# Altium schematic sheet schematic_total.SchDoc
size 297 x 209 mm; SheetNumber: 1; SheetTotal: 1
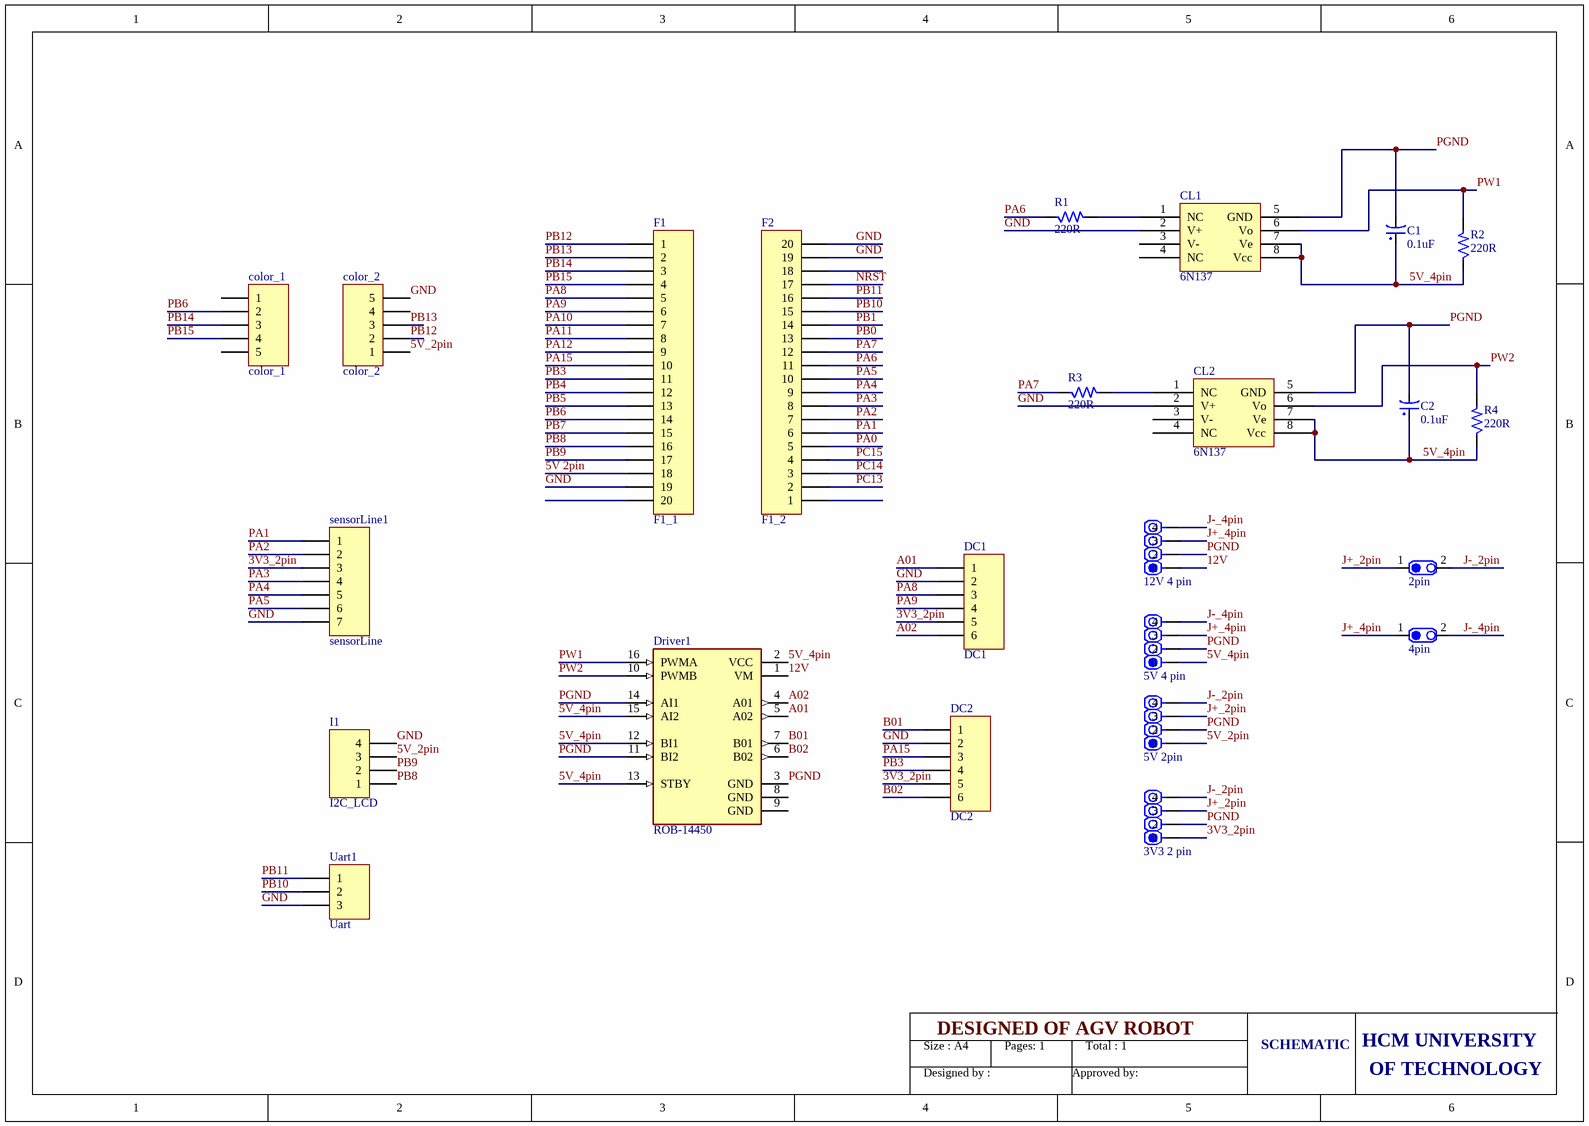
[diagram p0: schematic_total.SchDoc]

## Parts
2pin  IO  [CON.HDR1X2]  (value not drawn)
3V3_2_pin  IO  [CON.HDR1X4]  (value not drawn)
4pin  IO  [CON.HDR1X2]  (value not drawn)
5V_2pin  IO  [CON.HDR1X4]  (value not drawn)
5V_4_pin  IO  [CON.HDR1X4]  (value not drawn)
12V_4_pin  IO  [CON.HDR1X4]  (value not drawn)
C1  0.1uF  [CP1/2]
C2  0.1uF  [CP1/2]
CL1  6N137  [DIP-8]
CL2  6N137  [DIP-8]
color_1  color_1  [HDR1X5]
color_2  color_2  [HDR1X5]
DC1  DC1  [HDR1X6]
DC2  DC2  [HDR1X6]
Driver1  ROB-14450  [MODULE_ROB-14450]
F1  F1_1  [HDR1X20]
F2  F1_2  [HDR1X20]
I1  I2C_LCD  [HDR1X4]
R1  220R  [R1/4W]
R2  220R  [R1/4W]
R3  220R  [R1/4W]
R4  220R  [R1/4W]
sensorLine1  sensorLine  [HDR1X7]
Uart1  Uart  [HDR1X3]

## Nets
3V3_2pin: 3V3_2_pin.1 DC1.5 DC2.5 sensorLine1.3
5V 2pin: F1.18
5V_2pin: 5V_2pin.1 color_2.1 I1.3
5V_4pin: 5V_4_pin.1 C1.1 C2.1 CL1.7(Ve) CL1.8(Vcc) CL2.7(Ve) CL2.8(Vcc) Driver1.2(VCC) Driver1.12(BI1) Driver1.13(STBY) Driver1.15(AI2) R2.1 R4.1
12V: 12V_4_pin.1 Driver1.1(VM)
A01: DC1.1 Driver1.5(A02)
A02: DC1.6 Driver1.4(A01)
B01: DC2.1 Driver1.7(B01)
B02: DC2.6 Driver1.6(B02)
GND: CL1.2(V+) CL2.2(V+) color_2.5 DC1.2 DC2.2 F1.19 F2.19 F2.20 I1.4 sensorLine1.7 Uart1.3
J+_2pin: 2pin.1 3V3_2_pin.3 5V_2pin.3
J+_4pin: 4pin.1 5V_4_pin.3 12V_4_pin.3
J-_2pin: 2pin.2 3V3_2_pin.4 5V_2pin.4
J-_4pin: 4pin.2 5V_4_pin.4 12V_4_pin.4
NRST: F2.17
PA0: F2.5
PA1: F2.6 sensorLine1.1
PA2: F2.7 sensorLine1.2
PA3: F2.8 sensorLine1.4
PA4: F2.9 sensorLine1.5
PA5: F2.10 sensorLine1.6
PA6: F2.11 R1.1
PA7: F2.12 R3.1
PA8: DC1.3 F1.5
PA9: DC1.4 F1.6
PA10: F1.7
PA11: F1.8
PA12: F1.9
PA15: DC2.3 F1.10
PB0: F2.13
PB1: F2.14
PB3: DC2.4 F1.11
PB4: F1.12
PB5: F1.13
PB6: color_1.2 F1.14
PB7: F1.15
PB8: F1.16 I1.1
PB9: F1.17 I1.2
PB10: F2.15 Uart1.2
PB11: F2.16 Uart1.1
PB12: color_2.2 F1.1
PB13: color_2.3 F1.2
PB14: color_1.3 F1.3
PB15: color_1.4 F1.4
PC13: F2.2
PC14: F2.3
PC15: F2.4
PGND: 3V3_2_pin.2 5V_2pin.2 5V_4_pin.2 12V_4_pin.2 C1.2 C2.2 CL1.5(GND) CL2.5(GND) Driver1.3(GND) Driver1.11(BI2) Driver1.14(AI1)
PW1: CL1.6(Vo) Driver1.16(PWMA) R2.2
PW2: CL2.6(Vo) Driver1.10(PWMB) R4.2
NetCL1_1: CL1.1(NC) R1.2
NetCL2_1: CL2.1(NC) R3.2

Not connected (* = marked no-connect by the designer): CL1 3(V-) 4(NC); CL2 3(V-) 4(NC); color_1 1 5; color_2 4; Driver1 8(GND) 9(GND); F1 20; F2 1 18

## Notes on the sheet
- Size : A4
- Designed by :
- DESIGNED OF AGV ROBOT
- Pages: 1
- Approved by:
- Total : 1
- SCHEMATIC
- OF TECHNOLOGY
- HCM UNIVERSITY

## Library data of the parts
2pin 4pin = CON.HDR1x2: Header 1x2; Publisher: Hoang Nguyen; ComponentLink1Description: Digikey Part link; ComponentLink2Description: Open DataSheet; ComponentLink2URL: H:\LIBRARY\LIBRARY.Datasheet\
3V3_2_pin 5V_2pin 5V_4_pin 12V_4_pin = CON.HDR1x4: Header 1x4; Publisher: Hoang Nguyen; ComponentLink1Description: Digikey Part link; ComponentLink2Description: Open DataSheet; ComponentLink2URL: H:\LIBRARY\LIBRARY.Datasheet\
C1 C2 = CP1: Cap P  0,1uF < 22uF , 16 - 50V; Value: 10uF/50V; Description 1: 10 => 220uF/6,3V/10V - 10uF => 100uF/16V; Description 2: 0,1uF => 33uF/50V - 10uF => 22uF/63V; Description 3: 0,47uF => 10uF/100V
CL1 CL2 = 6N137: Single-Channel, High Speed 10MBit/s Logic Gate Optocouplers
color_1 = Header 5: Header, 5-Pin; LatestRevisionDate: 17-Jul-2002; LatestRevisionNote: Re-released for DXP Platform.; Publisher: Altium Limited
color_2 = Header 5_1: Header, 5-Pin; LatestRevisionDate: 17-Jul-2002; LatestRevisionNote: Re-released for DXP Platform.; Publisher: Altium Limited
DC1 = Header 6: Header, 6-Pin; LatestRevisionDate: 17-Jul-2002; LatestRevisionNote: Re-released for DXP Platform.; Publisher: Altium Limited
DC2 = Header 6_1: Header, 6-Pin; LatestRevisionDate: 17-Jul-2002; LatestRevisionNote: Re-released for DXP Platform.; Publisher: Altium Limited
Driver1 = ROB-14450: TB6612FNG Motor Controller/Driver Power Management Evaluation Board; MF: SparkFun Electronics; Check_prices: https://www.snapeda.com/parts/ROB-14450/SparkFun%20Electronics/view-part/2656367/?ref=eda; Package: None; MP: ROB-14450; Value: *; Availability: In Stock; SnapEDA_Link: https://www.snapeda.com/parts/ROB-14450/SparkFun%20Electronics/view-part/2656367/?ref=snap; Price: None
F1 = Header 20: Header, 20-Pin; LatestRevisionDate: 17-Jul-2002; LatestRevisionNote: Re-released for DXP Platform.; Publisher: Altium Limited
F2 = Header 20_1: Header, 20-Pin; LatestRevisionDate: 17-Jul-2002; LatestRevisionNote: Re-released for DXP Platform.; Publisher: Altium Limited
I1 = Header 4: Header, 4-Pin; LatestRevisionDate: 17-Jul-2002; LatestRevisionNote: Re-released for DXP Platform.; Publisher: Altium Limited
R1-R4 = R: Resistor 1/4W; Value: R1/4W - 1K
sensorLine1 = Header 7: Header, 7-Pin; LatestRevisionDate: 17-Jul-2002; LatestRevisionNote: Re-released for DXP Platform.; Publisher: Altium Limited
Uart1 = Header 3: Header, 3-Pin; LatestRevisionDate: 17-Jul-2002; LatestRevisionNote: Re-released for DXP Platform.; Publisher: Altium Limited